# EAGLE schematic 3 (EAGLE 6.5.0)
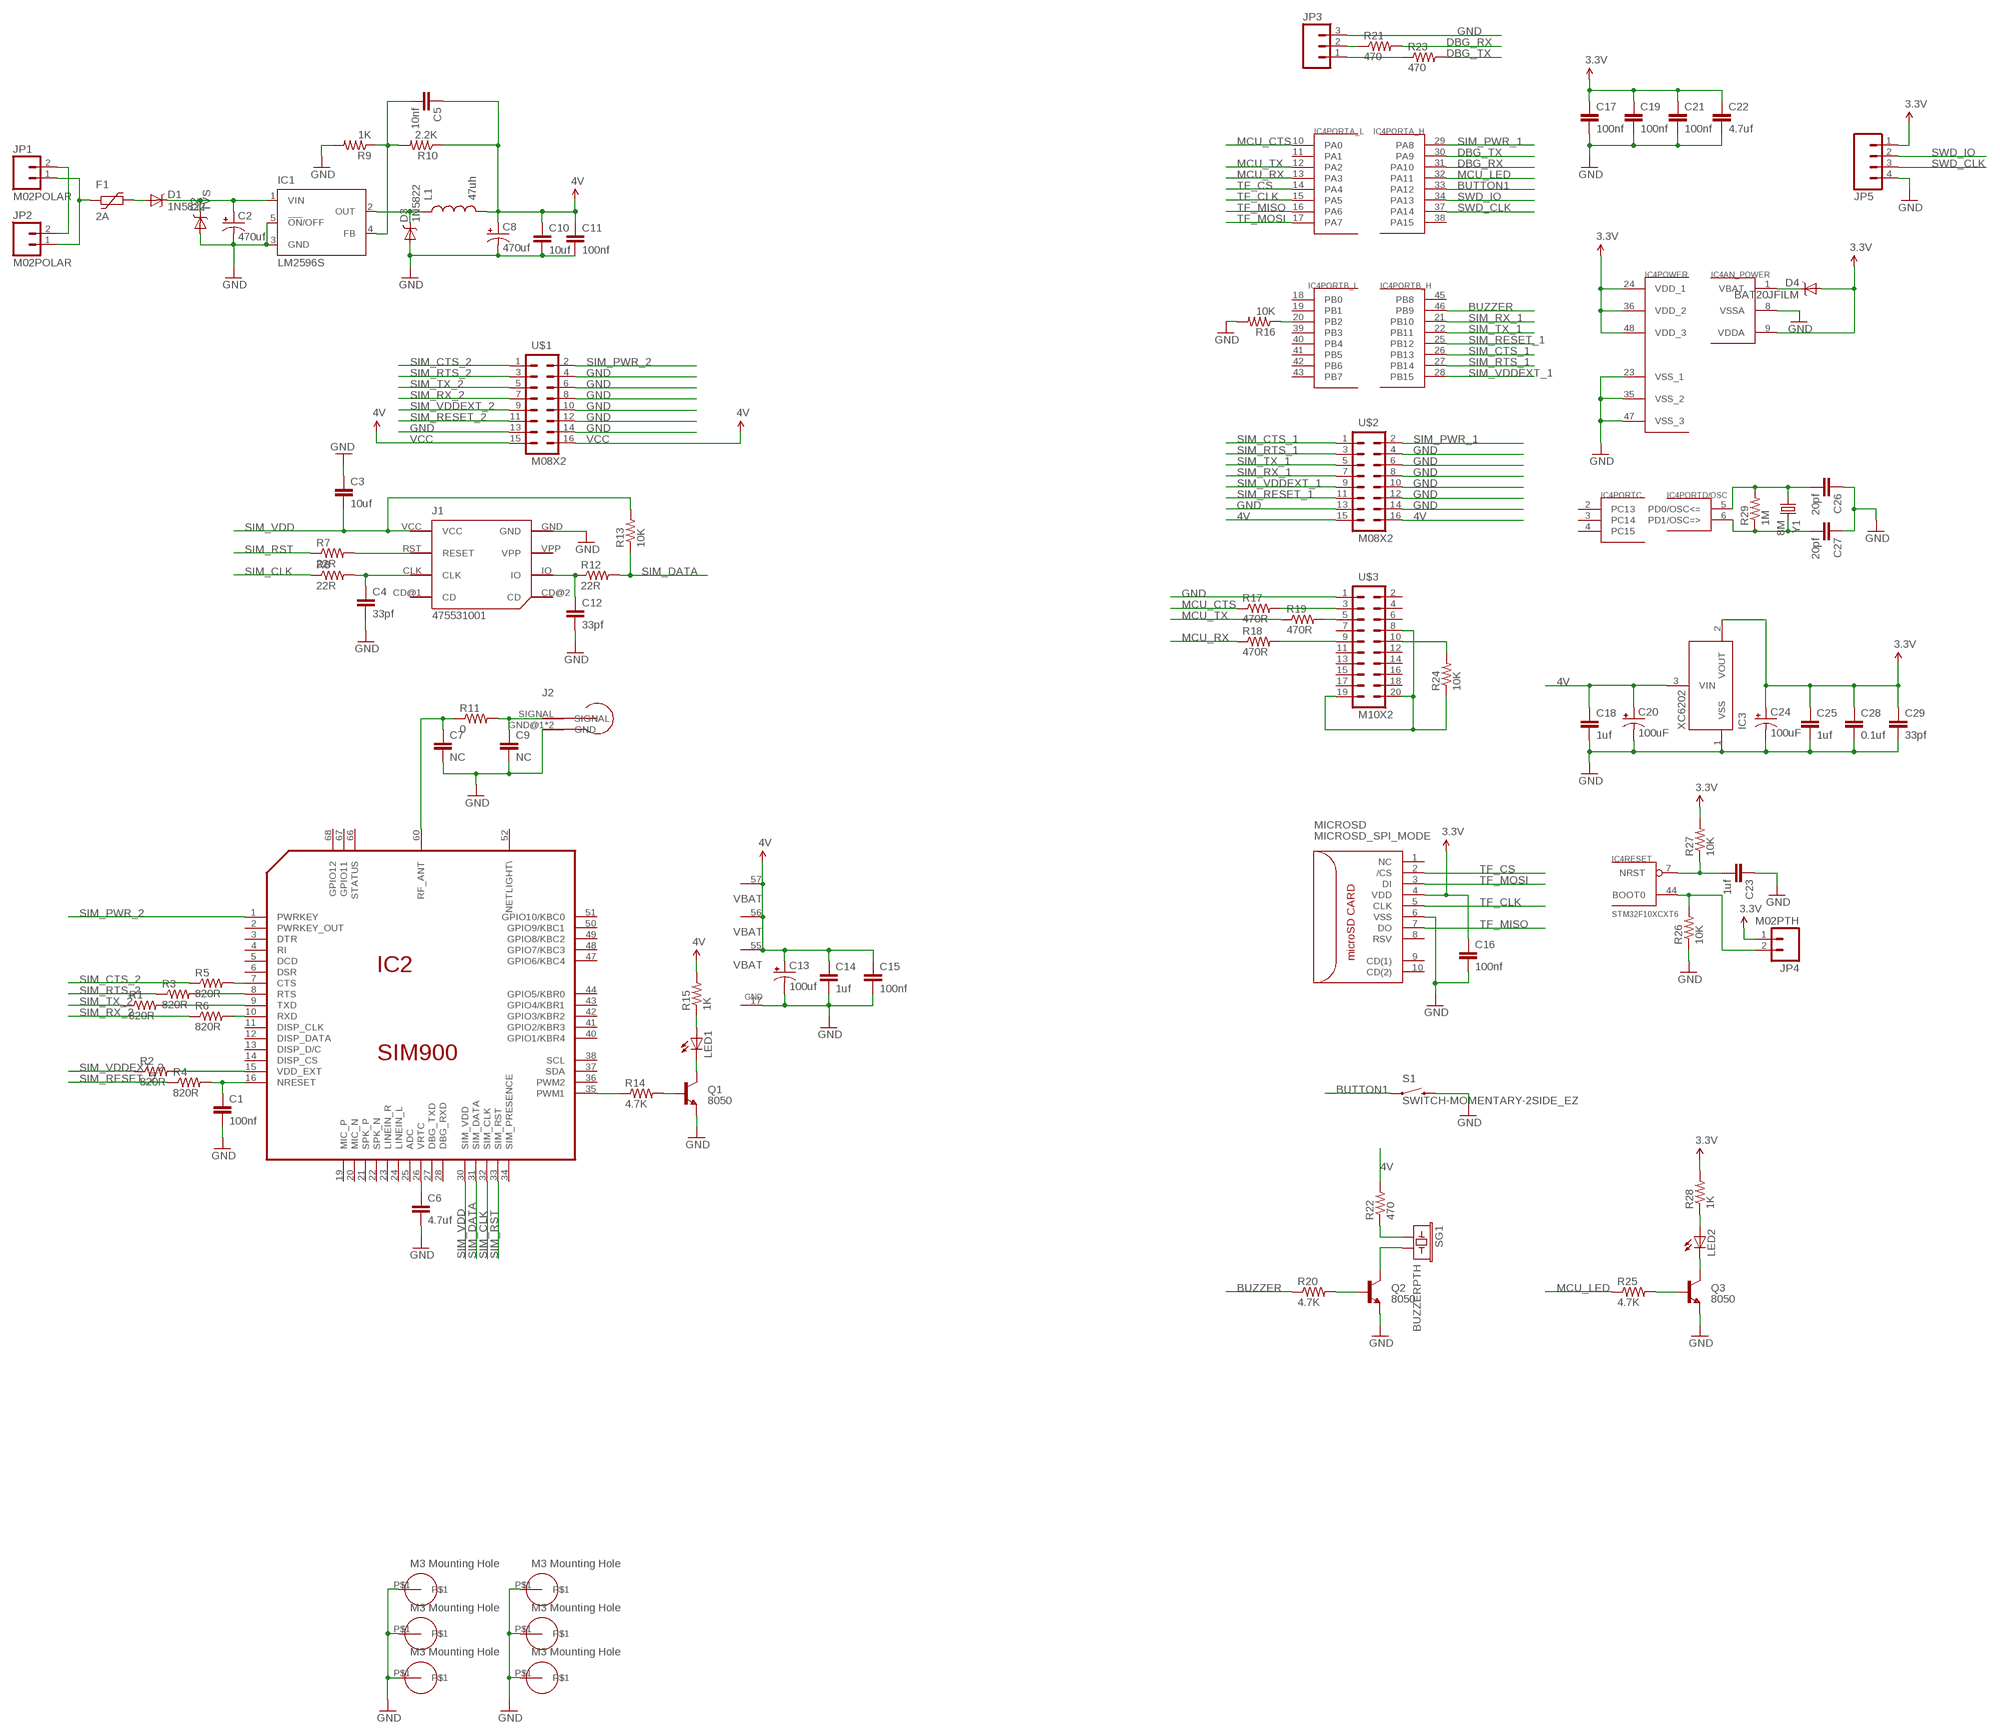
[diagram p0: schematic, sheet 1]

## Parts
C1  100nf  CAP0603-CAP  [0603-CAP]
C2  470uf  CAP_POLPTH4  [CPOL-RADIAL-1000UF-25V]
C3  10uf  CAP0603-CAP  [0603-CAP]
C4  33pf  CAP0603-CAP  [0603-CAP]
C5  10nf  CAP0603-CAP  [0603-CAP]
C6  4.7uf  CAP0603-CAP  [0603-CAP]
C7  NC  CAP0603-CAP  [0603-CAP]
C8  470uf  CAP_POLG  [PANASONIC_G]
C9  NC  CAP0603-CAP  [0603-CAP]
C10  10uf  CAP0603-CAP  [0603-CAP]
C11  100nf  CAP0603-CAP  [0603-CAP]
C12  33pf  CAP0603-CAP  [0603-CAP]
C13  100uf  CAP_POL6032  [EIA6032]
C14  1uf  CAP0603-CAP  [0603-CAP]
C15  100nf  CAP0603-CAP  [0603-CAP]
C16  100nf  CAP0603-CAP  [0603-CAP]
C17  100nf  CAP0603-CAP  [0603-CAP]
C18  1uf  CAP0603-CAP  [0603-CAP]
C19  100nf  CAP0603-CAP  [0603-CAP]
C20  100uF  10UF-20V-10%(TANT)  [EIA3528]
C21  100nf  CAP0603-CAP  [0603-CAP]
C22  4.7uf  CAP0603-CAP  [0603-CAP]
C23  1uf  CAP0603-CAP  [0603-CAP]
C24  100uF  10UF-20V-10%(TANT)  [EIA3528]
C25  1uf  CAP0603-CAP  [0603-CAP]
C26  20pf  CAP0603-CAP  [0603-CAP]
C27  20pf  CAP0603-CAP  [0603-CAP]
C28  0.1uf  CAP0603-CAP  [0603-CAP]
C29  33pf  CAP0603-CAP  [0603-CAP]
D1  1N5822  DIODE-SCHOTTKT-SMB  [SMB-DIODE]
D2  TVS  TVS_SMB  [SMB-DIODE]
D3  1N5822  DIODE-SCHOTTKT-SMB  [SMB-DIODE]
D4  BAT20JFILM  [SOD-323]
F1  2A  PTC-FUSE1812L  [1812L]
IC1  LM2596S  [TO263-5]
IC2  SIM900  [SIM900]
IC3  XC6202  XC6206  [SOT23-3]
IC4  STM32F10XCXT6  [TQFP48]
J1  475531001  [475531001]
J2  IPEX  [IPEX]
JP1  M02POLAR  [MOLEX-1X2]
JP2  M02POLAR  [MOLEX-1X2]
JP3  M03PTH  [1X03]
JP4  M02PTH  [1X02]
JP5  M04PTH  [1X04]
L1  47uh  IHLP4040DZ  [IHLP4040DZ]
LED1  LEDSML0805  [SML0805]
LED2  LED3MM  [LED3MM]
MICROSD  MICROSD_SPI_MODE  [MICRO_SD_CONNECTOR]
Q1  8050  TRANSISTOR_NPNSOT23  [SOT23]
Q2  8050  TRANSISTOR_NPNSOT23  [SOT23]
Q3  8050  TRANSISTOR_NPNSOT23  [SOT23]
R1  820R  RESISTOR0603-RES  [0603-RES]
R2  820R  RESISTOR0603-RES  [0603-RES]
R3  820R  RESISTOR0603-RES  [0603-RES]
R4  820R  RESISTOR0603-RES  [0603-RES]
R5  820R  RESISTOR0603-RES  [0603-RES]
R6  820R  RESISTOR0603-RES  [0603-RES]
R7  22R  1M-1%  [0603-RES]
R8  22R  1M-1%  [0603-RES]
R9  1K  RESISTOR0603-RES  [0603-RES]
R10  2.2K  RESISTOR0603-RES  [0603-RES]
R11  0  1M-1%  [0603-RES]
R12  22R  1M-1%  [0603-RES]
R13  10K  1M-1%  [0603-RES]
R14  4.7K  1M-1%  [0603-RES]
R15  1K  RESISTOR0603-RES  [0603-RES]
R16  10K  1M-1%  [0603-RES]
R17  470R  1M-1%  [0603-RES]
R18  470R  1M-1%  [0603-RES]
R19  470R  1M-1%  [0603-RES]
R20  4.7K  1M-1%  [0603-RES]
R21  470  1M-1%  [0603-RES]
R22  470  1M-1%  [0603-RES]
R23  470  1M-1%  [0603-RES]
R24  10K  1M-1%  [0603-RES]
R25  4.7K  1M-1%  [0603-RES]
R26  10K  RESISTOR0603-RES  [0603-RES]
R27  10K  RESISTOR0603-RES  [0603-RES]
R28  1K  1M-1%  [0603-RES]
R29  1M  1M-1%  [0603-RES]
S1  SWITCH-MOMENTARY-2SIDE_EZ  [TACTILE-PTH-SIDEEZ]
SG1  BUZZERPTH  [BUZZER-12MM]
U$1  M08X2  [2X8]
U$2  M08X2  [2X8]
U$3  M10X2  [2X10]
U$4  M3_MOUNTING_HOLE  [M3_MOUNTING_HOLE]
U$5  M3_MOUNTING_HOLE  [M3_MOUNTING_HOLE]
U$7  M3_MOUNTING_HOLE  [M3_MOUNTING_HOLE]
U$8  M3_MOUNTING_HOLE  [M3_MOUNTING_HOLE]
U$10  M3_MOUNTING_HOLE  [M3_MOUNTING_HOLE]
U$11  M3_MOUNTING_HOLE  [M3_MOUNTING_HOLE]
Y1  8M  CRYSTALHC49US  [HC49US]

## Nets
3.3V: C16.1 C17.1 C19.1 C21.1 C22.1 C24.A(+) C25.1 C28.1 C29.1 D4.2(A) IC3.2(VOUT) IC4.9(AN_POWER:VDDA) IC4.24(POWER:VDD_1) IC4.36(POWER:VDD_2) IC4.48(POWER:VDD_3) JP4.1 JP5.1 MICROSD.4(VDD) R27.2 R28.2
4V: C18.1 C20.A(+) IC3.3(VIN) R22.2 U$2.15 U$2.16
BUTTON1: IC4.33(PORTA_H:PA12) S1.1
BUZZER: IC4.46(PORTB_H:PB9) R20.1
DBG_RX: IC4.31(PORTA_H:PA10) R21.2
DBG_TX: IC4.30(PORTA_H:PA9) R23.2
GND: C1.2 C2.2(-) C3.1 C4.2 C6.2 C7.2 C8.- C9.2 C10.2 C11.2 C12.2 C13.P$2(-) C14.2 C15.2 C16.2 C17.2 C18.2 C19.2 C20.C(-) C21.2 C22.2 C23.1 C24.C(-) C25.2 C26.1 C27.1 C28.2 C29.2 D2.A D3.A IC1.3(GND) IC1.5(!ON!/OFF) IC2.17(GND) IC3.1(VSS) IC4.8(AN_POWER:VSSA) IC4.23(POWER:VSS_1) IC4.35(POWER:VSS_2) IC4.47(POWER:VSS_3) J1.GND J2.GND@1(GND) J2.GND@2(GND) JP3.3 JP5.4 MICROSD.6(VSS) Q1.2(E) Q2.2(E) Q3.2(E) R9.2 R16.2 R26.1 S1.2 U$1.4 U$1.6 U$1.8 U$1.10 U$1.12 U$1.13 U$1.14 U$2.4 U$2.6 U$2.8 U$2.10 U$2.12 U$2.13 U$2.14 U$3.1 U$4.P$1 U$5.P$1 U$7.P$1 U$8.P$1 U$10.P$1 U$11.P$1
MCU_CTS: IC4.10(PORTA_L:PA0) R17.1
MCU_LED: IC4.32(PORTA_H:PA11) R25.1
MCU_RX: IC4.13(PORTA_L:PA3) R18.1
MCU_TX: IC4.12(PORTA_L:PA2) R19.1
N$1: D4.1(C) IC4.1(AN_POWER:VBAT)
N$2: C26.2 IC4.5(PORTD/OSC:PD0/OSC<=) R29.2 Y1.1
N$3: C27.2 IC4.6(PORTD/OSC:PD1/OSC=>) R29.1 Y1.2
N$4: C23.2 IC4.7(RESET:NRST) R27.1
N$5: IC4.44(RESET:BOOT0) JP4.2 R26.2
N$6: R24.1 U$3.8 U$3.19 U$3.20
N$7: JP1.2 JP2.2
N$8: D3.C IC1.2(OUT) L1.P$1
N$9: C2.1(+) D1.C D2.C IC1.1(VIN)
N$10: F1.P$1 JP1.1 JP2.1
N$11: C5.2 IC1.4(FB) R9.1 R10.2
N$12: R17.2 U$3.3
N$13: R19.2 U$3.5
N$14: LED1.C Q1.3(C)
N$15: R24.2 U$3.10
N$16: C7.1 IC2.60(RF_ANT) R11.1
N$17: IC4.20(PORTB_L:PB2) R16.1
N$18: C9.1 J2.SIGNAL R11.2
N$19: D1.A F1.P$2
N$20: IC2.15(VDD_EXT) R2.2
N$21: IC2.35(PWM1) R14.1
N$22: Q1.1(B) R14.2
N$23: LED1.A R15.1
N$24: J1.RST(RESET) R7.2
N$25: C6.1 IC2.26(VRTC)
N$27: Q3.1(B) R25.2
N$29: C1.1 IC2.16(NRESET) R4.2
N$30: IC2.7(CTS) R5.2
N$33: IC2.8(RTS) R3.2
N$34: IC2.9(TXD) R1.2
N$35: C12.1 J1.IO R12.1
N$36: IC2.10(RXD) R6.2
N$37: JP3.2 R21.1
N$38: JP3.1 R23.1
N$39: C4.1 J1.CLK R8.2
N$57: Q2.1(B) R20.2
N$58: R22.1 SG1.+
N$59: Q2.3(C) SG1.-
N$60: R18.2 U$3.9
N$61: LED2.A R28.1
N$62: LED2.K(C) Q3.3(C)
SIM_CLK: IC2.32(SIM_CLK) R8.1
SIM_CTS_1: IC4.26(PORTB_H:PB13) U$2.1
SIM_CTS_2: R5.1 U$1.1
SIM_DATA: IC2.31(SIM_DATA) R12.2 R13.1
SIM_PWR_1: IC4.29(PORTA_H:PA8) U$2.2
SIM_PWR_2: IC2.1(PWRKEY) U$1.2
SIM_RESET_1: IC4.25(PORTB_H:PB12) U$2.11
SIM_RESET_2: R4.1 U$1.11
SIM_RST: IC2.33(SIM_RST) R7.1
SIM_RTS_1: IC4.27(PORTB_H:PB14) U$2.3
SIM_RTS_2: R3.1 U$1.3
SIM_RX_1: IC4.21(PORTB_H:PB10) U$2.7
SIM_RX_2: R6.1 U$1.7
SIM_TX_1: IC4.22(PORTB_H:PB11) U$2.5
SIM_TX_2: R1.1 U$1.5
SIM_VDD: C3.2 IC2.30(SIM_VDD) J1.VCC R13.2
SIM_VDDEXT_1: IC4.28(PORTB_H:PB15) U$2.9
SIM_VDDEXT_2: R2.1 U$1.9
SWD_CLK: IC4.37(PORTA_H:PA14) JP5.3
SWD_IO: IC4.34(PORTA_H:PA13) JP5.2
TF_CLK: IC4.15(PORTA_L:PA5) MICROSD.5(CLK)
TF_CS: IC4.14(PORTA_L:PA4) MICROSD.2(/CS)
TF_MISO: IC4.16(PORTA_L:PA6) MICROSD.7(DO)
TF_MOSI: IC4.17(PORTA_L:PA7) MICROSD.3(DI)
VCC: C5.1 C8.+ C10.1 C11.1 C13.P$1(+) C14.1 C15.1 IC2.55(VBAT) IC2.56(VBAT) IC2.57(VBAT) L1.P$2 R10.1 R15.2 U$1.15 U$1.16 ; supply symbol labelled 4V
Unconnected: IC2.2(PWRKEY_OUT) IC2.3(DTR) IC2.4(RI) IC2.5(DCD) IC2.6(DSR) IC2.11(DISP_CLK) IC2.12(DISP_DATA) IC2.13(DISP_D/C) IC2.14(DISP_CS) IC2.19(MIC_P) IC2.20(MIC_N) IC2.21(SPK_P) IC2.22(SPK_N) IC2.23(LINEIN_R) IC2.24(LINEIN_L) IC2.25(ADC) IC2.27(DBG_TXD) IC2.28(DBG_RXD) IC2.34(SIM_PRESENCE) IC2.36(PWM2) IC2.37(SDA) IC2.38(SCL) IC2.40(GPIO1/KBR4) IC2.41(GPIO2/KBR3) IC2.42(GPIO3/KBR2) IC2.43(GPIO4/KBR1) IC2.44(GPIO5/KBR0) IC2.47(GPIO6/KBC4) IC2.48(GPIO7/KBC3) IC2.49(GPIO8/KBC2) IC2.50(GPIO9/KBC1) IC2.51(GPIO10/KBC0) IC2.52(NETLIGHT\) IC2.66(STATUS) IC2.67(GPIO11) IC2.68(GPIO12) IC4.2(PORTC:PC13) IC4.3(PORTC:PC14) IC4.4(PORTC:PC15) IC4.11(PORTA_L:PA1) IC4.18(PORTB_L:PB0) IC4.19(PORTB_L:PB1) IC4.38(PORTA_H:PA15) IC4.39(PORTB_L:PB3) IC4.40(PORTB_L:PB4) IC4.41(PORTB_L:PB5) IC4.42(PORTB_L:PB6) IC4.43(PORTB_L:PB7) IC4.45(PORTB_H:PB8) J1.CD@1(CD) J1.CD@2(CD) J1.VPP MICROSD.1(NC) MICROSD.8(RSV) MICROSD.9(CD(1)) MICROSD.10(CD(2)) U$3.2 U$3.4 U$3.6 U$3.7 U$3.11 U$3.12 U$3.13 U$3.14 U$3.15 U$3.16 U$3.17 U$3.18

## Power pins joined to a net without a drawn wire
GND: IC2.18(GND) IC2.29(GND) IC2.39(GND) IC2.45(GND) IC2.46(GND) IC2.53(GND) IC2.54(GND) IC2.58(GND) IC2.59(GND) IC2.61(GND) IC2.62(GND) IC2.63(GND) IC2.64(GND) IC2.65(GND)

## Library data of the parts
C1 C3-C7 C9-C12 C14-C19 C21-C23 C25-C29 = SparkFun-Passives:CAP: Capacitor Standard 0603 ceramic capacitor, and 0.1" leaded capacitor.
C2 C8 = SparkFun-Capacitors:CAP_POL: Capacitor Polarized These are standard SMD and PTH capacitors. Normally 10uF, 47uF, and 100uF in electrolytic and tantalum varieties. Always verify the external diameter of the through hole cap, it varies with capacity, voltage, and manufacturer. The EIA devices should be standard.
C13 = SparkFun-Passives:CAP_POL: Capacitor Polarized These are standard SMD and PTH capacitors. Normally 10uF, 47uF, and 100uF in electrolytic and tantalum varieties. Always verify the external diameter of the through hole cap, it varies with capacity, voltage, and manufacturer. The EIA devices should be standard.
C20 C24 = SparkFun-Capacitors:10UF-20V-10%(TANT): CAP-08063; PROD_ID: CAP-08063; VALUE: 10uF
D1 D3 = SparkFun-DiscreteSemi:DIODE-SCHOTTKT-SMB
D2 = SparkFun-DiscreteSemi:TVS_SMB
D4 = SparkFun-DiscreteSemi:BAT20JFILM: 23V, 1A Schottky diode, SOD-323 package; PROD_ID: DIO-11623
F1 = digital-toy:PTC-FUSE
IC1 = national-semiconductor:LM2596: SIMPLE SWITCHER® Power Converter 150 kHz 3A Step-Down Voltage Regulator Source: http://www.national.com/ds/LM/LM2596.pdf
IC2 = sim900:SIM900
IC3 = SparkFun-PowerIC:XC6206: Low ESR Cap. Compatible Positive Voltage Regulator
IC4 = stm32:STM32F10XCXT6: ST STM32F101/103 48pin LQFP
J1 = simcard:475531001: MOLEX SIM Card Holder 47553-1001 1.27mm Pitch SIM Card Holder with 2 Detect Pins, 6 Circuits, Push-Push Style, Housing Height 1.80mm, with Pegs, Lead-Free
J2 = SparkFun-RF:IPEX
JP1 JP2 JP4 = SparkFun-Connectors:M02: Standard 2-pin 0.1" header. Use with - straight break away headers ( PRT-00116) - right angle break away headers (PRT-00553) - swiss pins (PRT-00743) - machine pins (PRT-00117) - female headers (PRT-00115) Molex polarized connector foot print use with: PRT-08233 with associated crimp pins and housings. 2.54_SCREWTERM for use with PRT-10571. 3.5mm Screw Terminal footprints for PRT-08084 5mm Screw Terminal footprints for use with PRT-08433
JP3 = SparkFun-Connectors:M03: Header 3 Standard 3-pin 0.1" header. Use with straight break away headers (SKU : PRT-00116), right angle break away headers (PRT-00553), swiss pins (PRT-00743), machine pins (PRT-00117), and female headers (PRT-00115). Molex polarized connector foot print use with SKU : PRT-08232 with associated crimp pins and housings.
JP5 = SparkFun-Connectors:M04: Header 4 Standard 4-pin 0.1" header. Use with straight break away headers (SKU : PRT-00116), right angle break away headers (PRT-00553), swiss pins (PRT-00743), machine pins (PRT-00117), and female headers (PRT-00115). Molex polarized connector foot print use with SKU : PRT-08231 with associated crimp pins and housings. 1MM SMD Version SKU: PRT-10208
L1 = SparkFun-Passives:IHLP4040DZ
LED1 = led:LED: LED OSRAM: - CHIPLED LG R971, LG N971, LY N971, LG Q971, LY Q971, LO R971, LY R971 LH N974, LH R974 LS Q976, LO Q976, LY Q976 LO Q996 - Hyper CHIPLED LW Q18S LB Q993, LB Q99A, LB R99A - SideLED LS A670, LO A670, LY A670, LG A670, LP A670 LB A673, LV A673, LT A673, LW A673 LH A674 LY A675 LS A676, LA A676, LO A676, LY A676, LW A676 LS A679, LY A679, LG A679 - Hyper Micro SIDELED® LS Y876, LA Y876, LO Y876, LY Y876 LT Y87S - SmartLED LW L88C, LW L88S LB L89C, LB L89S, LG L890 LS L89K, LO L89K, LY L89K LS L896, LA L896, LO L896, LY L896 - TOPLED LS T670, LO T670, LY T670, LG T670, LP T670 LSG T670, LSP T670, LSY T670, LOP T670, LYG T670 LG T671, LOG T671, LSG T671 LB T673, LV T673, LT T673, LW T673 LH T674 LS T676, LA T676, LO T676, LY T676, LB T676, LH T676, LSB T676, LW T676 LB T67C, LV T67C, LT T67C, LS T67K, LO T67K, LY T67K, LW E67C LS E67B, LA E67B, LO E67B, LY E67B, LB E67C, LV E67C, LT E67C LW T67C LS T679, LY T679, LG T679 LS T770, LO T770, LY T770, LG T770, LP T770 LB T773, LV T773, LT T773, LW T773 LH T774 LS E675, LA E675, LY E675, LS T675 LS T776, LA T776, LO T776, LY T776, LB T776 LHGB T686 LT T68C, LB T68C - Hyper Mini TOPLED® LB M676 - Mini TOPLED Santana® LG M470 LS M47K, LO M47K, LY M47K Source: http://www.osram.convergy.de LUXEON: - LUMILED® LXK2-PW12-R00, LXK2-PW12-S00, LXK2-PW14-U00, LXK2-PW14-V00 LXK2-PM12-R00, LXK2-PM12-S00, LXK2-PM14-U00 LXK2-PE12-Q00, LXK2-PE12-R00, LXK2-PE12-S00, LXK2-PE14-T00, LXK2-PE14-U00 LXK2-PB12-K00, LXK2-PB12-L00, LXK2-PB12-M00, LXK2-PB14-N00, LXK2-PB14-P00, LXK2-PB14-Q00 LXK2-PR12-L00, LXK2-PR12-M00, LXK2-PR14-Q00, LXK2-PR14-R00 LXK2-PD12-Q00, LXK2-PD12-R00, LXK2-PD12-S00 LXK2-PH12-R00, LXK2-PH12-S00 LXK2-PL12-P00, LXK2-PL12-Q00, LXK2-PL12-R00 Source: www.luxeon.com KINGBRIGHT: KA-3528ASYC Source: www.kingbright.com
LED2 = SparkFun-LED:LED: LEDs Standard schematic elements and footprints for 5mm, 3mm, 1206, and 0603 sized LEDs. 5mm - Spark Fun Electronics SKU : COM-00529 (and others)
MICROSD = con-molex-microsd:MICROSD_SPI_MODE: MOLEX - 49225-0821 - CONNECTEUR MICRO SD PUSH/PUSH REV Fabricant: MOLEX Code commande Farnell: 1366700 <http://fr.farnell.com/molex/49225-0821/connecteur-micro-sd-push-push-rev/dp/1366700?Ntt=1366700> Référence fabricant: 49225-0821
Q1-Q3 = SparkFun-DiscreteSemi:TRANSISTOR_NPN: Generic NPN BJT MMBT2222A - TRANS-08049 (SOT-23, 1A 40V) MPSA42 - TRANS-09116 (SOT-23, 500mA 300V) MMBT5088LT1G - TRANS-11160 (SOT-23, 50 mA 30V)
R1-R6 R9 R10 R15 R26 R27 = SparkFun-Passives:RESISTOR: Resistor Basic schematic elements and footprints for 0603, 1206, and PTH resistors.
R7 R8 R11-R14 R16-R25 R28 = SparkFun-Resistors:1M-1%: 1M-ohm SMT 1/10W - 1% (0603) RES-07868; PROD_ID: RES-07868; VALUE: 1M
R29 = SparkFun-Resistors:1M-1%: 1M-ohm SMT 1/10W - 1% (0603) RES-07868; PROD_ID: RES-07868
S1 = SparkFun-Electromechanical:SWITCH-MOMENTARY-2: Various NO switches- pushbuttons, reed, etc
SG1 = SparkFun-Electromechanical:BUZZER: Buzzer 12mm Spark Fun Electronics SKU : Comp-Buzzer
U$1 U$2 = SparkFun-Connectors:M08X2: .1" headers, two rows of 8 each
U$3 = SparkFun-Connectors:M10X2: This was SPECIALLY designed to be used with our Graphic LCD Backpack. Be sure you want to use this! It is not only staggered on each line of header holes, but IT IS ALSO offset of the center point of the top and bottom lines by 5 mil. This causes the headers to lock into place on the "standard" footprint on the LCD screen. The extra squares on the tdocu layer are there simply to reference other pins (if you were to actually populate a longer header than ten long - this is what we do with the backpacks).
U$4 U$5 U$7 U$8 U$10 U$11 = SparkFun-Aesthetics:M3_MOUNTING_HOLE
Y1 = SparkFun-FreqCtrl:CRYSTAL: Various standard crystals. Proven footprints. Spark Fun Electronics SKU : COM-00534